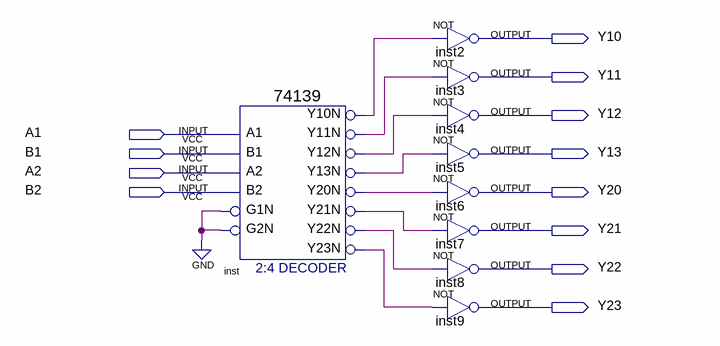
[diagram p0: schematic sheet]
// Quartus schematic 22-44.bdf as structural Verilog: 9 symbols, 12 pins
module \22-44  (
  input  A1,
  input  B1,
  input  A2,
  input  B2,
  output Y10,
  output Y11,
  output Y12,
  output Y13,
  output Y20,
  output Y21,
  output Y22,
  output Y23
);

  wire inst_y10n, inst_y11n, inst_y12n, inst_y13n, inst_y20n, inst_y21n, inst_y22n, inst_y23n;

  \74139  inst (
    .A1(A1), .A2(A2), .B1(B1), .B2(B2), .G1N(1'b0), .G2N(1'b0), .Y10N(inst_y10n), .Y20N(inst_y20n),
    .Y13N(inst_y13n), .Y12N(inst_y12n), .Y11N(inst_y11n), .Y21N(inst_y21n), .Y22N(inst_y22n), .Y23N(inst_y23n));
  not inst2 (Y10, inst_y10n);
  not inst3 (Y11, inst_y11n);
  not inst4 (Y12, inst_y12n);
  not inst5 (Y13, inst_y13n);
  not inst6 (Y20, inst_y20n);
  not inst7 (Y21, inst_y21n);
  not inst8 (Y22, inst_y22n);
  not inst9 (Y23, inst_y23n);
endmodule
